# EasyEDA schematic SCH_stepperdrivertry4-2stdvr-copy_2025-12-06.json
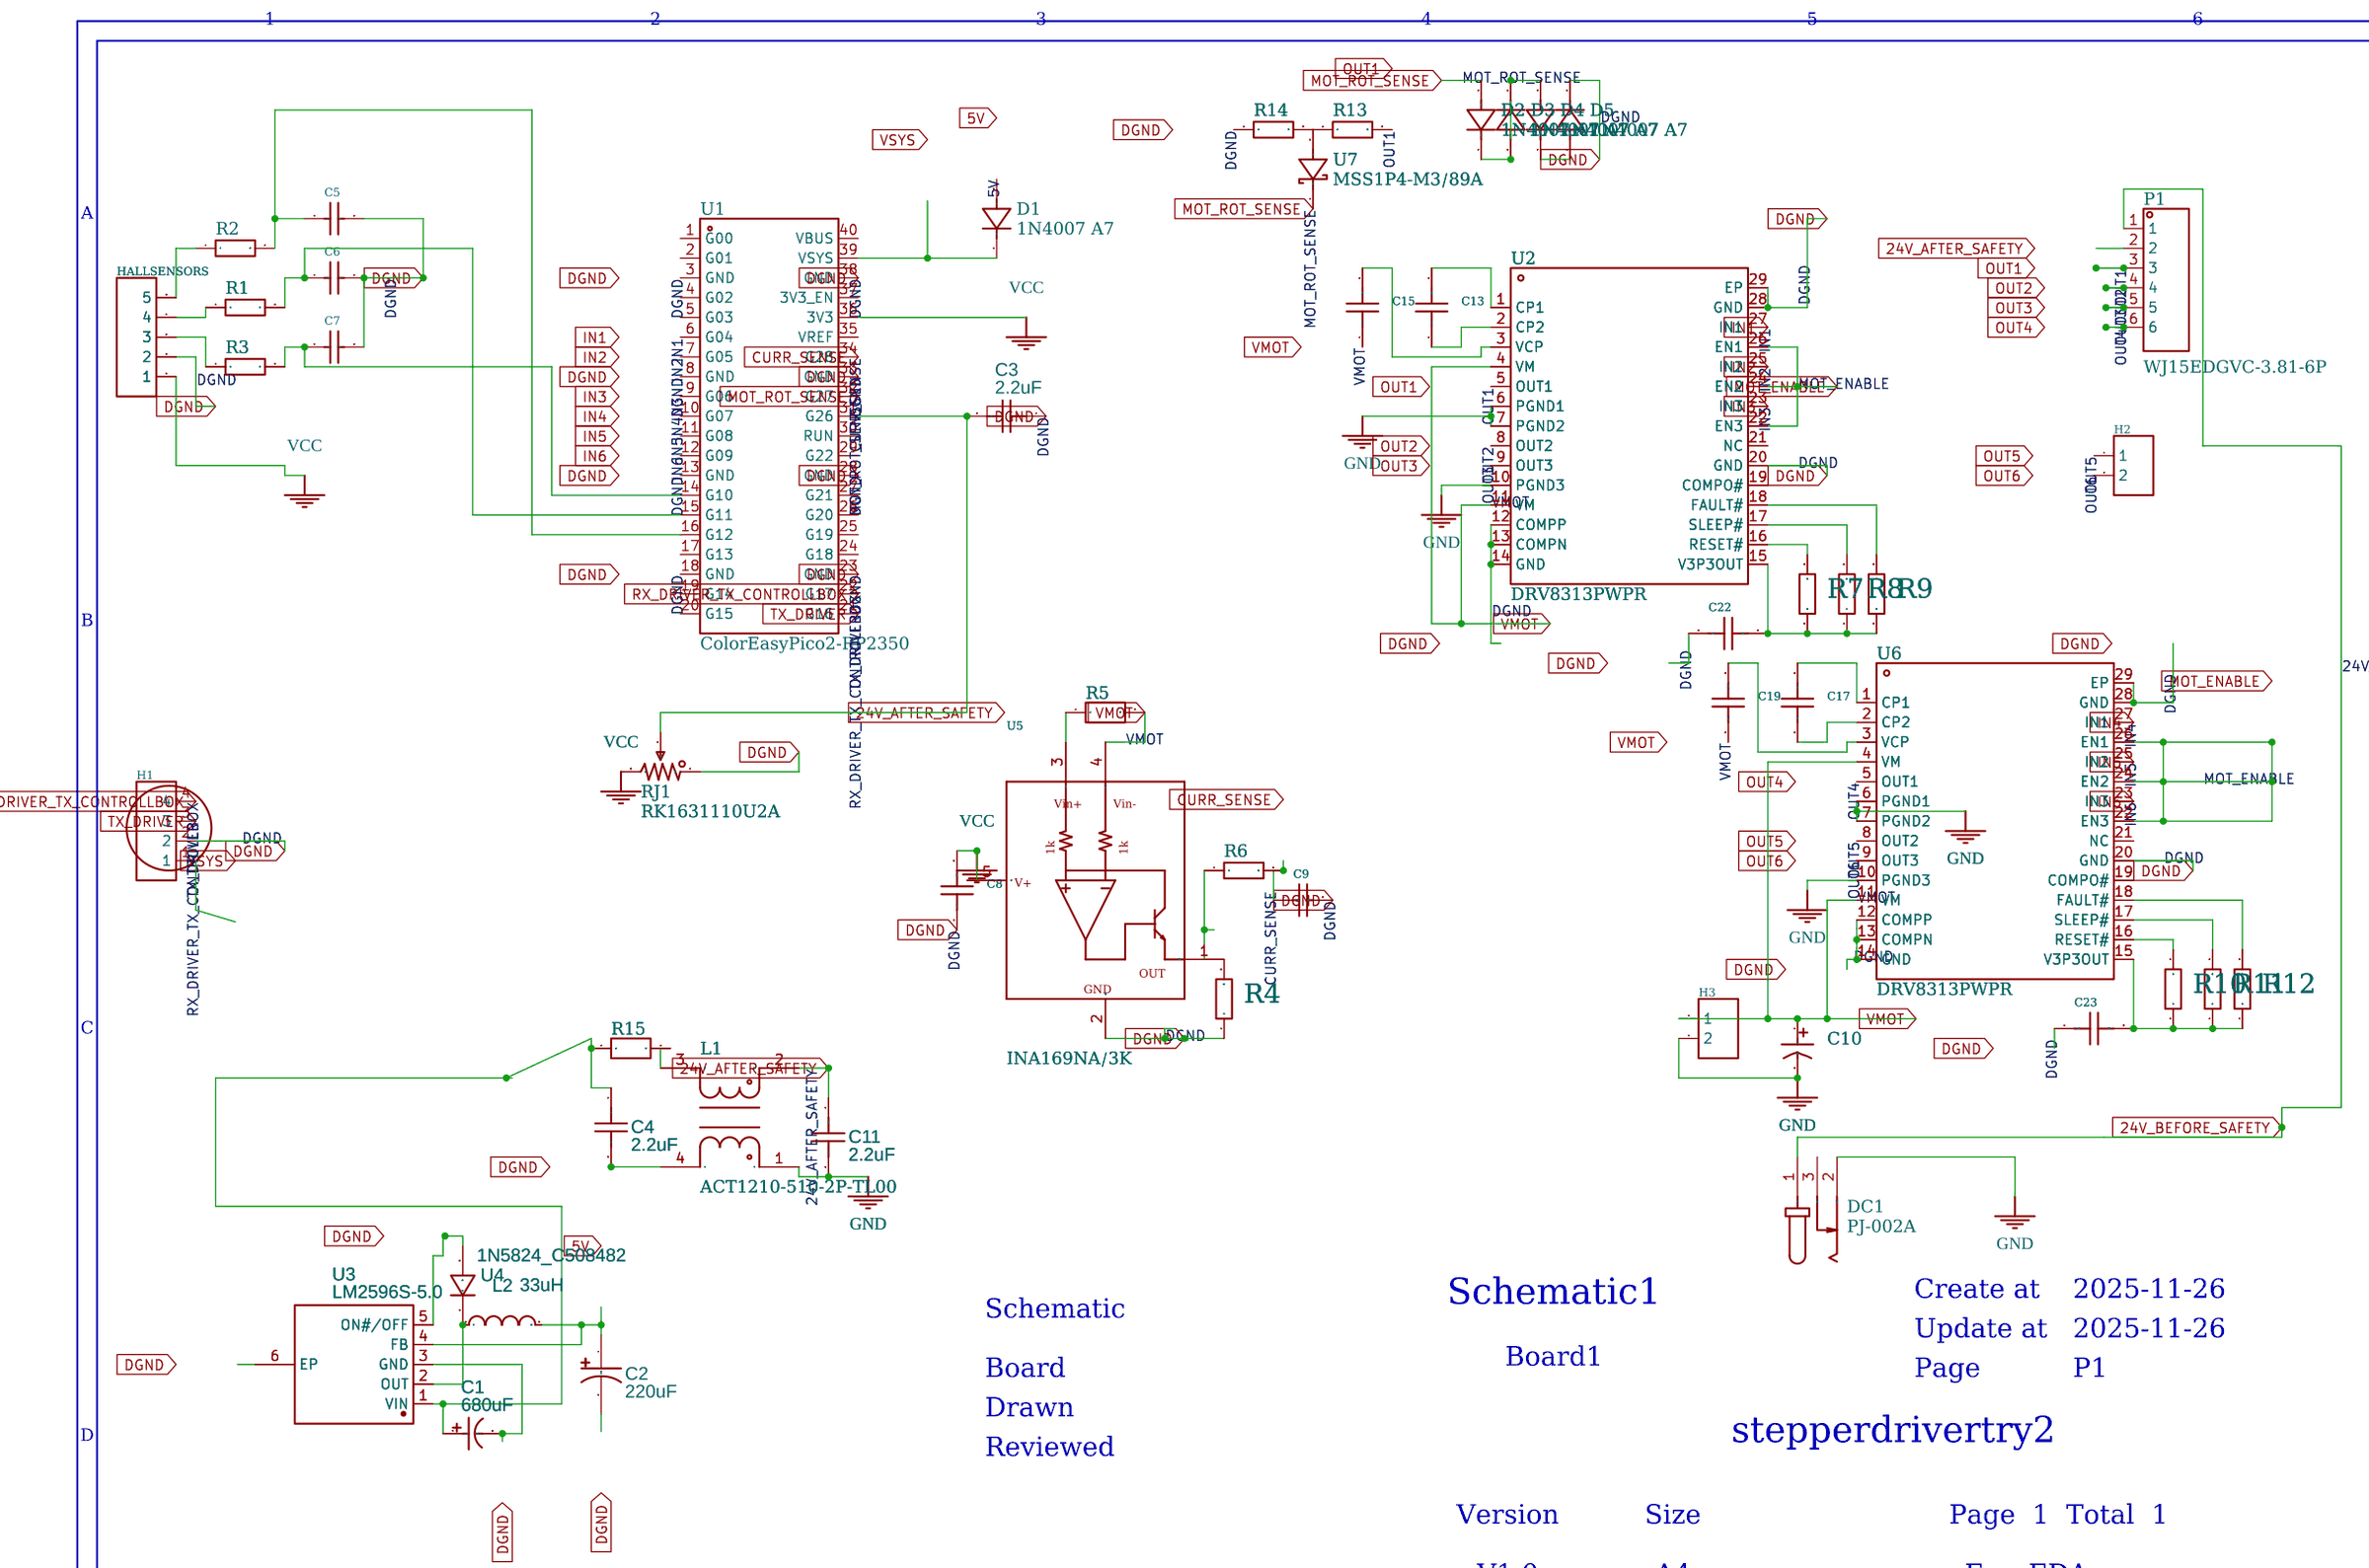
[diagram p0: schematic sheet]

## Parts
C1  680uF  [CAP-SMD_BD12.5-L13.0-W13.0-RD]
C2  220uF  [CAP-SMD_BD8.0-L8.3-W8.3-FD]
C3  2.2uF  [C0805]
C4  2.2uF  [C0805]
C5  10nF  [C0603]
C6  10nF  [C0603]
C7  10nF  [C0603]
C8  100nF  [C0603]
C9  10nF  [C0603]
C10  100uF  [CAP-SMD_BD6.3-L6.6-W6.6-LS7.6-FD]
C11  2.2uF  [C0805]
C13  100nF  [C0603]
C15  100nF  [C0603]
C17  100nF  [C0603]
C19  100nF  [C0603]
C22  100nF  [C0603]
C23  100nF  [C0603]
D1  1N4007 A7  [SOD-123FL_L2.8-W1.8-LS3.7-RD]
D2  1N4007 A7  [SOD-123FL_L2.8-W1.8-LS3.7-RD]
D3  1N4007 A7  [SOD-123FL_L2.8-W1.8-LS3.7-RD]
D4  1N4007 A7  [SOD-123FL_L2.8-W1.8-LS3.7-RD]
D5  1N4007 A7  [SOD-123FL_L2.8-W1.8-LS3.7-RD]
DC1  PJ-002A  [DC-IN-TH_PJ-002A]
H1  NO  [HDR-TH_4P-P2.54-V-F]
H2  NO  [HDR-TH_2P-P2.54-V-F]
H3  NO  [HDR-TH_2P-P2.54-V-F]
HALLSENSORS  NO  [HDR-TH_5P-P2.54-V-F]
L1  ACT1210-510-2P-TL00  [FILTER-SMD_4P-L3.2-W2.5-BL_ACT1210]
L2  33uH  [IND-SMD_L12.3-W12.3]
P1  WJ15EDGVC-3.81-6P  [CONN-TH_6P_WJ15EDGVC-3.81-6P]
R1  1kΩ  [R0603]
R2  1kΩ  [R0603]
R3  1kΩ  [R0603]
R4  10kΩ  [R0603]
R5  100mΩ  [RES-SMD_L6.4-W3.2-R2512]
R6  1kΩ  [R0603]
R7  10kΩ  [R0603]
R8  10kΩ  [R0603]
R9  10kΩ  [R0603]
R10  10kΩ  [R0603]
R11  10kΩ  [R0603]
R12  10kΩ  [R0603]
R13  1MΩ  [R0603]
R14  10kΩ  [R0603]
R15  1Ω  [R1206]
RJ1  RK1631110U2A  [RES-ADJ-TH_RK1631110U2A]
U1  ColorEasyPico2-RP2350  [COMM-TH_COLOREASYPICO2-RP2350]
U2  DRV8313PWPR  [HTSSOP-28_L9.8-W4.5-P0.65-LS6.6-BL-EP]
U3  LM2596S-5.0  [TO-263-5_L10.2-W8.9-P1.70-BR]
U4  1N5824_C508482  [DO-201AD_BD5.3-L9.5-P13.50-D1.4-RD]
U5  INA169NA/3K  [SOT-23-5_L3.0-W1.7-P0.95-LS2.8-BR]
U6  DRV8313PWPR  [HTSSOP-28_L9.8-W4.5-P0.65-LS6.6-BL-EP]
U7  MSS1P4-M3/89A  [DO-219AD_L2.2-W1.3-L-RD_MSS2P2-M3-89A]

## Library data of the parts
C1 = RVT1V681M1213: Supplier: LCSC; Manufacturer: ROQANG(容强); Supplier Part: C98216; JLCPCB Part Class: Extended Part
C2 = BXJ 35V220uF: Contributor: LCSC; JLCPCB Part Class: Extended Part; Supplier: LCSC; Supplier Part: C165523; Manufacturer: SAMYOUNG(韩国三莹); Manufacturer Part: BXJ35V220M8*10 8.0TP
C3 C4 C11 = CL21A225KBQNNNE: Contributor: LCSC; Supplier: LCSC; Supplier Part: C377773; Manufacturer: SAMSUNG(三星); JLCPCB Part Class: Basic Part
C5-C7 C9 = -: Symbol: 0603B103K500NT; Device: 0603B103K500NT; Supplier: LCSC; Manufacturer: FH(风华); Manufacturer Part: 0603B103K500NT; Supplier Part: C57112; JLCPCB Part Class: Basic Part; LCSC Part Name: 10nF ±10% 50V; Supplier Footprint: 0603; Datasheet: https://item.szlcsc.com/datasheet/0603B103K500NT/58143.html; Add into BOM: yes; Convert to PCB: yes; Tolerance: ±10%; Voltage Rating: 50V; Temperature Coefficient: X7R
C8 C13 C15 C17 C19 C22 C23 = -: Symbol: CL10B104KB8NNNC; Device: CL10B104KB8NNNC; Supplier: LCSC; Manufacturer: SAMSUNG(三星); Manufacturer Part: CL10B104KB8NNNC; Supplier Part: C1591; JLCPCB Part Class: Extended Part; LCSC Part Name: 100nF ±10% 50V; Supplier Footprint: 0603; Datasheet: https://item.szlcsc.com/datasheet/CL10B104KB8NNNC/1943.html; Add into BOM: yes; Convert to PCB: yes; Tolerance: ±10%; Voltage Rating: 50V; Temperature Coefficient: X7R
C10 = -: Symbol: RVT1V101M0607; Device: RVT1V101M0607_C72478; LCSC Part Name: 100uF ±20% 35V; Supplier Part: C72478; Manufacturer: ROQANG(容强); Manufacturer Part: RVT1V101M0607; Supplier Footprint: SMD,D6.3xL7.7mm; JLCPCB Part Class: Extended Part; Datasheet: https://item.szlcsc.com/datasheet/RVT1V101M0607/73589.html; Supplier: LCSC; Add into BOM: yes; Convert to PCB: yes; Tolerance: ±20%; Voltage Rating: 35V; Ripple Current: 69mA@120Hz; Diameter: 6.3mm; Height - Seated (Max): 7.7mm; Lifetime: 2000hrs@105℃; Operating Temperature: -40℃+105℃
D1-D5 = -: Supplier Part: C2902912; Manufacturer: MSKSEMI(美森科); Supplier Footprint: SOD-123FL; JLCPCB Part Class: Extended Part; Datasheet: https://item.szlcsc.com/datasheet/1N4007%2520A7/3157366.html; Supplier: LCSC; Add into BOM: yes; Convert to PCB: yes; Voltage - Forward(Vf@If): 1V@1A; Voltage - DC Reverse(Vr): 1kV; Current - Rectified: 1A; Reverse Leakage Current (Ir): 10uA@1kV; Operating Junction Temperature Range: -55℃+150℃
DC1 = -: LCSC Part Name: 内径:2mm 外径:5.5mm; Supplier Part: C3096082; Manufacturer: CUI; Supplier Footprint: 插件; JLCPCB Part Class: Extended Part; Datasheet: https://item.szlcsc.com/datasheet/PJ-002A/3655316.html; Supplier: LCSC; Add into BOM: yes; Convert to PCB: yes; Inside Contact Diameter: 2mm; Outside Contact Diameter: 5.5mm; Current Rating: 2.5A; Voltage Rating (Max): 24V; Operating Temperature: -25℃+85℃
H1 = -: Symbol: 2.54-1*4P母; Device: HDR-F_2.54_1x4P; Supplier: LCSC; Supplier Part: C2718488; Manufacturer: BOOMELE(博穆精密); Manufacturer Part: 2.54-1*4P母; JLCPCB Part Class: Extended Part; Convert to PCB: yes; Add into BOM: yes; Supplier Footprint: Through
H2 H3 = -: Symbol: Header-Female-2.54_1x2; Device: HDR-F_2.54_1x2P; Supplier: LCSC; Manufacturer: BOOMELE(博穆精密); Manufacturer Part: 2.54-1*2P母; Supplier Part: C49661; JLCPCB Part Class: Extended Part; Convert to PCB: yes; Add into BOM: yes; Supplier Footprint: Through
HALLSENSORS = -: Symbol: Header-Female-2.54_1x5; Device: HDR-F_2.54_1x5P; Supplier: LCSC; Manufacturer: BOOMELE(博穆精密); Manufacturer Part: 2.54-1*5P母; Supplier Part: C50950; JLCPCB Part Class: Extended Part; Convert to PCB: yes; Add into BOM: yes; Supplier Footprint: Through
L1 = -: LCSC Part Name: 两路 共模滤波器 阻抗2.6kΩ@10MHz; Supplier Part: C95572; Manufacturer: TDK; Supplier Footprint: SMD-4P,3.2x2.5mm; JLCPCB Part Class: Extended Part; Datasheet: https://item.szlcsc.com/datasheet/ACT1210-510-2P-TL00/96776.html; Supplier: LCSC; Add into BOM: yes; Convert to PCB: yes; Number of Lines: 2; Current Rating: 200mA; Inductance @ Frequency: 51uH@100kHz; Voltage Rating - DC: 80V; Impedance @ Frequency: 2.6kΩ@10MHz; DC Resistance(DCR): 700mΩ; Operating Temperature: -55℃+150℃
L2 = SMDRI127-330MT: Supplier: LCSC; Manufacturer: SXN(顺翔诺); Supplier Part: C9400; JLCPCB Part Class: Extended Part
P1 = -: Symbol: WJ15EDGVC-6P; LCSC Part Name: 1x6P 3.81mm 排数:1 每排P数:6; Supplier Part: C8415; Manufacturer: KANGNEX(康奈克斯电气); Supplier Footprint: 插件,P=3.81mm; JLCPCB Part Class: Extended Part; Datasheet: https://item.szlcsc.com/datasheet/WJ15EDGVC-3.81-6P/8909.html; Supplier: LCSC; Add into BOM: yes; Convert to PCB: yes; Connector Type: Board Side/Socket - Closed; Number of Positions or Pins: 1x6P; Pitch: 3.81mm; Mounting Type: Straight Pin; Number of Pins: 6P; Number of Rows: 1; Number of PINs Per Row: 6; Operating Temperature: -40℃+105℃
R1-R3 R6 = -: Symbol: 0603WAF1001T5E; Device: 0603WAF1001T5E; LCSC Part Name: 1kΩ ±1% 100mW 厚膜电阻; Supplier Part: C21190; Manufacturer: UNI-ROYAL(厚声); Manufacturer Part: 0603WAF1001T5E; Supplier Footprint: 0603; JLCPCB Part Class: Basic Part; Datasheet: https://item.szlcsc.com/datasheet/0603WAF1001T5E/21904.html; Supplier: LCSC; Add into BOM: yes; Convert to PCB: yes; Type: Thick Film Resistor; Tolerance: ±1%; Power(Watts): 100mW; Voltage-Supply(Max): 75V; Temperature Coefficient: ±100ppm/℃; Operating Temperature: -55℃+155℃
R4 R7-R12 = -: Symbol: 0603WAF1002T5E; Device: 0603WAF1002T5E; LCSC Part Name: 厚膜电阻 10kΩ ±1% 100mW; Supplier Part: C25804; Manufacturer: UNI-ROYAL(厚声); Manufacturer Part: 0603WAF1002T5E; Supplier Footprint: 0603; JLCPCB Part Class: Basic Part; Datasheet: https://item.szlcsc.com/datasheet/0603WAF1002T5E/26547.html; Supplier: LCSC; Add into BOM: yes; Convert to PCB: yes; Type: Thick Film Resistor; Tolerance: ±1%; Power(Watts): 100mW; Voltage-Supply(Max): 75V; Temperature Coefficient: ±100ppm/℃; Operating Temperature: -55℃+155℃
R5 = -: Symbol: HOJLR2512-3W-100MR-1%; Device: HoJLR2512-3W-100mR-1%; LCSC Part Name: 100mΩ ±1% 3W; Supplier Part: C2903476; Manufacturer: Milliohm(毫欧); Manufacturer Part: HoJLR2512-3W-100mR-1%; Supplier Footprint: 2512; JLCPCB Part Class: Extended Part; Datasheet: https://item.szlcsc.com/datasheet/HoJLR2512-3W-100mR-1%2525/3159230.html; Supplier: LCSC; Add into BOM: yes; Convert to PCB: yes; Type: Current Sense Resistor; Tolerance: ±1%; Power(Watts): 3W; Mounting Type: Surface Mount
R13 = -: Symbol: RC0603FR-071ML; Device: RC0603FR-071ML; LCSC Part Name: 厚膜电阻 1MΩ ±1% 100mW; Supplier Part: C105578; Manufacturer: YAGEO(国巨); Manufacturer Part: RC0603FR-071ML; Supplier Footprint: 0603; JLCPCB Part Class: Extended Part; Datasheet: https://atta.szlcsc.com/upload/public/pdf/source/20181102/C105578_67A9388250AF143DE4682E62257D2969.pdf; Supplier: LCSC; Add into BOM: yes; Convert to PCB: yes; Type: Thick Film Resistors; Tolerance: ±1%; Temperature Coefficient: ±100ppm/℃; Operating Temperature Range: -55℃+155℃
R14 = -: Symbol: RC0603FR-0710KL; Device: RC0603FR-0710KL; LCSC Part Name: 厚膜电阻 10kΩ ±1% 100mW; Supplier Part: C98220; Manufacturer: YAGEO(国巨); Manufacturer Part: RC0603FR-0710KL; Supplier Footprint: 0603; JLCPCB Part Class: Extended Part; Datasheet: https://atta.szlcsc.com/upload/public/pdf/source/20180927/C295883_E8D83085EA81BD7DE0B2B681138C15EE.pdf; Supplier: LCSC; Add into BOM: yes; Convert to PCB: yes; Type: Thick Film Resistors; Tolerance: ±1%; Temperature Coefficient: ±100ppm/℃; Operating Temperature Range: -55℃+155℃
R15 = -: Symbol: FRC1206J1R0 TS; Device: FRC1206J1R0 TS; LCSC Part Name: 1Ω ±5% 250mW 厚膜电阻; Supplier Part: C2907442; Manufacturer: FOJAN(富捷); Manufacturer Part: FRC1206J1R0 TS; Supplier Footprint: 1206; JLCPCB Part Class: Extended Part; Datasheet: https://item.szlcsc.com/datasheet/FRC1206J1R0%2520TS/3180955.html; Supplier: LCSC; Add into BOM: yes; Convert to PCB: yes; Type: Thick Film Resistor; Tolerance: ±5%; Power(Watts): 250mW; Voltage-Supply(Max): 200V; Temperature Coefficient: ±200ppm/℃; Operating Temperature: -55℃+155℃
RJ1 = -: LCSC Part Name: RK1631110U2A 三件套; Supplier Part: C3007973; Manufacturer: ALPSALPINE(阿尔卑斯阿尔派); Supplier Footprint: 插件; JLCPCB Part Class: Extended Part; Datasheet: https://atta.szlcsc.com/upload/public/pdf/source/20220811/DF006DA1C1FC1909BE18ADD0BBA20DF6.pdf; Supplier: LCSC; Add into BOM: yes; Convert to PCB: yes
U1 = -: Symbol: COLOREASYPICO2-RP2350; LCSC Part Name: 立创·ColorEasyPico2开发板; Supplier Part: C42924268; Manufacturer: 立创开发板; JLCPCB Part Class: Extended Part; Datasheet: https://item.szlcsc.com/datasheet/ColorEasyPico2-RP2350/45024583.html; Supplier: LCSC; Add into BOM: yes; Convert to PCB: yes
U2 U6 = -: LCSC Part Name: 无刷直流BLDC电机驱动芯片 60V; Supplier Part: C92482; Manufacturer: TI(德州仪器); Supplier Footprint: HTSSOP-28; JLCPCB Part Class: Extended Part; Datasheet: https://www.ti.com/cn/lit/gpn/drv8313; Supplier: LCSC; Add into BOM: yes; Convert to PCB: yes; Drive Type: Three Phase; Integrated FETs: Yes; Number of Half Bridges: 3; Peak Current: 2.5A; Quiescent Current(Iq): 800uA; Operating Temperature: -40℃+125℃
U3 = LM2596S-5.0: Contributor: LCSC; Supplier: LCSC; Supplier Part: C347421; Manufacturer: UMW(友台半导体); Manufacturer Part: LM2596S-5.0(UMW); JLCPCB Part Class: Extended Part
U4 = 1N5824_C508482: Contributor: lcsc; Supplier: LCSC; Supplier Part: C508482; Manufacturer: SUNMATE(森美特); Manufacturer Part: 1N5824; JLCPCB Part Class: Extended Part
U5 = -: Symbol: INA169NA/3KG4; Supplier: LCSC; Manufacturer: TI(德州仪器); Supplier Part: C44322; JLCPCB Part Class: Extended Part; Supplier Footprint: SOT-23-5; Datasheet: https://www.ti.com/cn/lit/gpn/ina169; Add into BOM: yes; Convert to PCB: yes; Vcm - Common Mode Voltage: 2.7V60V; Bandwidth: 440kHz; Voltage - Supply: 2.7V60V; Operating Temperature: -40℃+85℃
U7 = -: LCSC Part Name: 电压:40V 电流:1A; Supplier Part: C2980309; Manufacturer: VISHAY(威世); Supplier Footprint: MicroSMP; JLCPCB Part Class: Extended Part; Datasheet: https://item.szlcsc.com/datasheet/MSS1P4-M3%252F89A/3401867.html; Supplier: LCSC; Add into BOM: yes; Convert to PCB: yes; Diode Configuration: 1 Independent; Voltage - Forward(Vf@If): 480mV@1A; Voltage - DC Reverse(Vr): 40V; Current - Rectified: 1A; Reverse Leakage Current (Ir): 200uA@40V; Operating Junction Temperature Range: -55℃+150℃; Non-Repetitive Peak Forward Surge Current: 25A

## Nets
5V: C2.1 D1.2(A) L2.2 U3.4(FB)
24V_AFTER_SAFETY: C11.1 L1.2 P1.2 R5.1 U5.3(VIN+)
24V_BEFORE_SAFETY: DC1.1 P1.1
DGND: C1.2 C2.2 C3.1 C4.2 C5.2 C6.2 C7.2 C8.1 C9.2 C22.1 C23.1 D5.1(K) H1.2 HALLSENSORS.2 L1.4 R4.1 R14.1 RJ1.1 U1.3(GND) U1.8(GND) U1.13(GND) U1.18(GND) U1.23(GND) U1.28(GND) U1.33(GND) U1.38(GND) U2.12(COMPP) U2.13(COMPN) U2.14(GND) U2.20(GND) U2.28(GND) U2.29(EP) U3.3(GND) U3.5(ON#/OFF) U3.6(EP) U4.2 U5.2(GND) U6.12(COMPP) U6.13(COMPN) U6.14(GND) U6.20(GND) U6.28(GND) U6.29(EP)
GND: C10.2 C11.2 DC1.2 H3.2 L1.1 U2.6(PGND1) U2.7(PGND2) U2.10(PGND3) U6.6(PGND1) U6.7(PGND2) U6.10(PGND3)
VCC: C8.2 HALLSENSORS.1 RJ1.3 U1.36(3V3) U5.5(V+)
CURR_SENSE: C9.1 R6.2 U1.34(G28)
IN1: U1.6(G04) U2.27(IN1)
IN2: U1.7(G05) U2.25(IN2)
IN3: U1.9(G06) U2.23(IN3)
IN4: U1.10(G07) U6.27(IN1)
IN5: U1.11(G08) U6.25(IN2)
IN6: U1.12(G09) U6.23(IN3)
MOT_ENABLE: U2.22(EN3) U2.24(EN2) U2.26(EN1) U6.22(EN3) U6.24(EN2) U6.26(EN1)
MOT_ROT_SENSE: D2.2(A) U1.32(G27) U7.1(C)
OUT1: P1.3 R13.2 U2.5(OUT1)
OUT2: P1.4 U2.8(OUT2)
OUT3: P1.5 U2.9(OUT3)
OUT4: P1.6 U6.5(OUT1)
OUT5: H2.1 U6.8(OUT2)
OUT6: H2.2 U6.9(OUT3)
RX_DRIVER_TX_CONTROLLBOX: H1.4 U1.22(G17)
TX_DRIVER: H1.3 U1.21(G16)
VMOT: C10.1 C15.1 C19.1 H3.1 R5.2 U2.4(VM) U2.11(VM) U5.4(VIN-) U6.4(VM) U6.11(VM)
VSYS: D1.1(K) H1.1 U1.39(VSYS)
Net-(C1-1): C1.1 C4.1 R15.1 U3.1(VIN)
Net-(C3-2): C3.2 RJ1.2 U1.31(G26)
Net-(C5-1): C5.1 R2.2 U1.16(G12)
Net-(C6-1): C6.1 R1.2 U1.15(G11)
Net-(C7-1): C7.1 R3.2 U1.14(G10)
Net-(C13-1): C13.1 U2.2(CP2)
Net-(C13-2): C13.2 U2.1(CP1)
Net-(C15-2): C15.2 U2.3(VCP)
Net-(C17-1): C17.1 U6.2(CP2)
Net-(C17-2): C17.2 U6.1(CP1)
Net-(C19-2): C19.2 U6.3(VCP)
Net-(C22-2): C22.2 R7.1 R8.1 R9.1 U2.15(V3P3OUT)
Net-(C23-2): C23.2 R10.1 R11.1 R12.1 U6.15(V3P3OUT)
Net-(D2-1): D2.1(K) D3.1(K) D3.2(A) D4.2(A)
Net-(D4-1): D4.1(K) D5.2(A)
Net-(HALLSENSORS-3): HALLSENSORS.3 R3.1
Net-(HALLSENSORS-4): HALLSENSORS.4 R1.1
Net-(HALLSENSORS-5): HALLSENSORS.5 R2.1
Net-(L1-3): L1.3 R15.2
Net-(L2-1): L2.1 U3.2(OUT) U4.1
Net-(R4-2): R4.2 R6.1 U5.1(OUT)
Net-(R7-2): R7.2 U2.16(RESET#)
Net-(R8-2): R8.2 U2.17(SLEEP#)
Net-(R9-2): R9.2 U2.18(FAULT#)
Net-(R10-2): R10.2 U6.16(RESET#)
Net-(R11-2): R11.2 U6.17(SLEEP#)
Net-(R12-2): R12.2 U6.18(FAULT#)
Net-(R13-1): R13.1 R14.2 U7.2(A)

Not connected (* = marked no-connect by the designer): DC1 3; U1 1(G00) 2(G01) 4(G02) 5(G03) 17(G13) 19(G14) 20(G15) 24(G18) 25(G19) 26(G20) 27(G21) 29(G22) 30(RUN) 35(VREF) 37(3V3_EN) 40(VBUS); U2 19(COMPO#) 21(NC); U6 19(COMPO#) 21(NC)

## Notes on the sheet
- 1
- 2
- 3
- 4
- 5
- 6
- A
- A
- B
- B
- C
- C
- Schematic1
- Create at
- 2025-11-26
- Schematic
- Update at
- 2025-11-26
- Board
- Board1
- Page
- P1
- Drawn
- D
- stepperdrivertry2
- D
- Reviewed
- Version
- Size
- Page  1  Total  1
- V1.0
- A4
- EasyEDA.com
- 1
- 2
- 3
- 4
- 5
- 6
